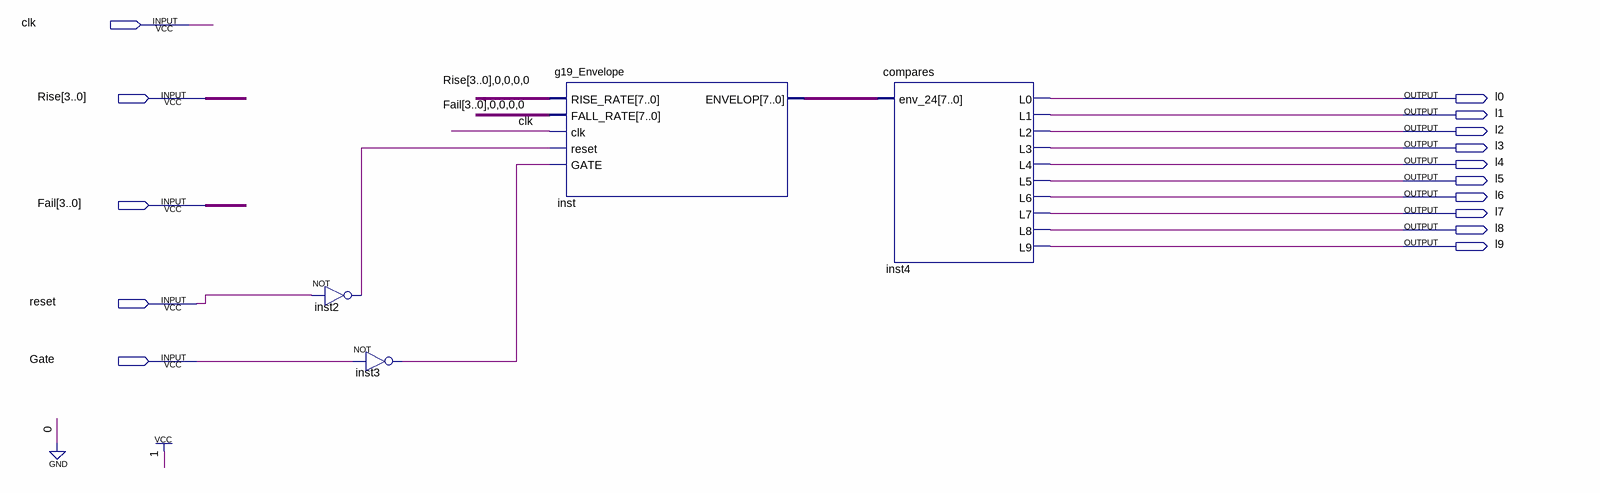
[diagram p0: schematic sheet]
// Quartus schematic envelope.bdf as structural Verilog: 4 symbols, 15 pins
module envelope (
  input  clk,
  input  [3:0] Rise,
  input  [3:0] Fail,
  input  reset,
  input  Gate,
  output l0,
  output l1,
  output l2,
  output l3,
  output l4,
  output l5,
  output l6,
  output l7,
  output l8,
  output l9
);

  wire inst2_out, inst3_out;
  wire [7:0] inst_envelop;

  not inst2 (inst2_out, reset);
  not inst3 (inst3_out, Gate);
  g19_Envelope inst (
    .RISE_RATE({Rise, 4'b0000}), .FALL_RATE({Fail, 4'b0000}), .clk(clk), .reset(inst2_out), .GATE(inst3_out),
    .ENVELOP(inst_envelop));
  compares inst4 (
    .env_24(inst_envelop), .L0(l0), .L1(l1), .L2(l2), .L3(l3), .L4(l4), .L5(l5), .L6(l6), .L7(l7), .L8(l8),
    .L9(l9));
endmodule
